# Altium project oleks-charge-verification.PrjPCB
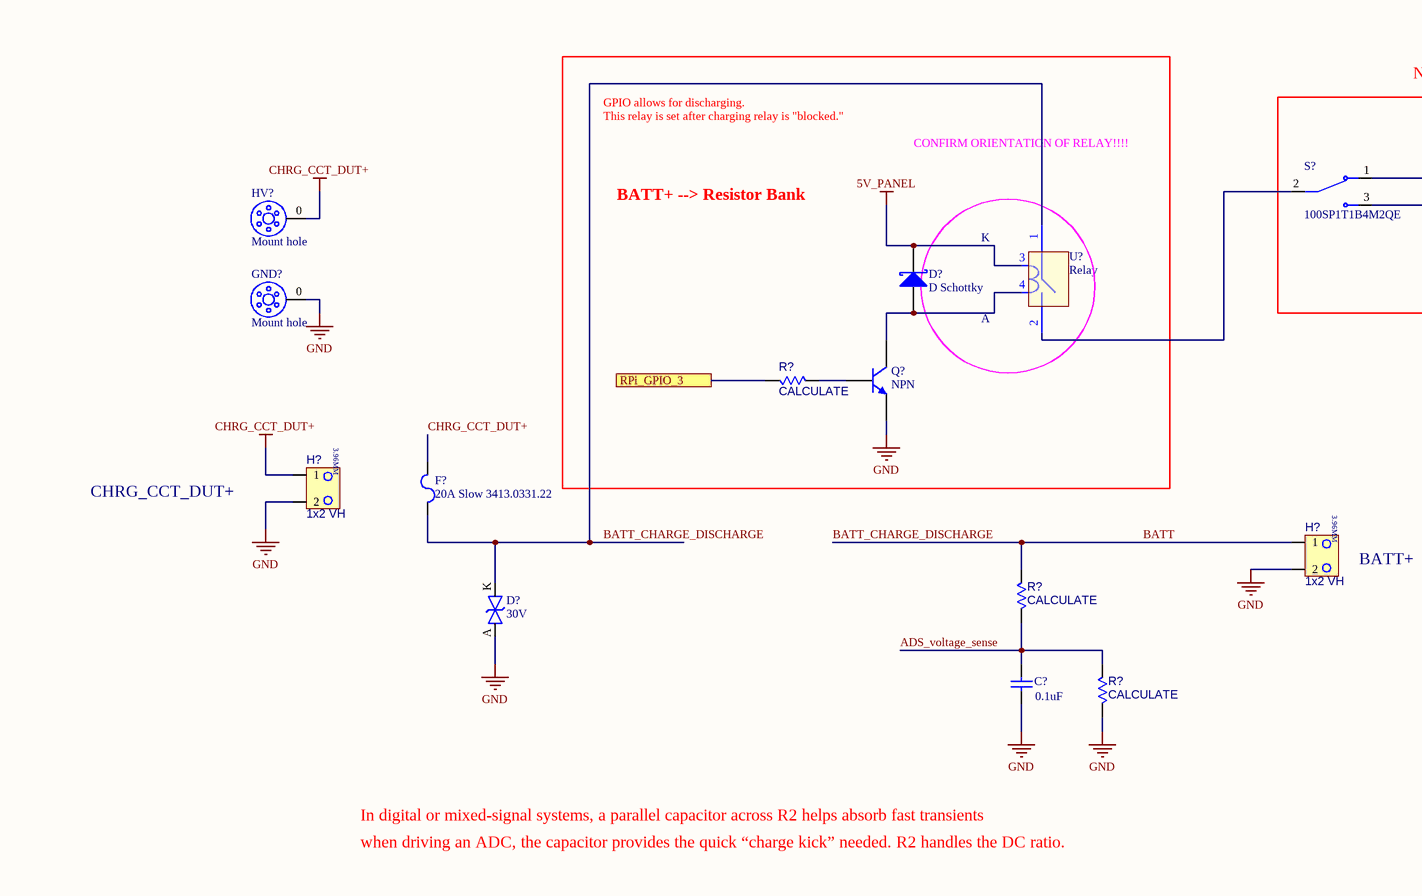
[diagram p0: oleks-charge-verification.SchDoc, top left]
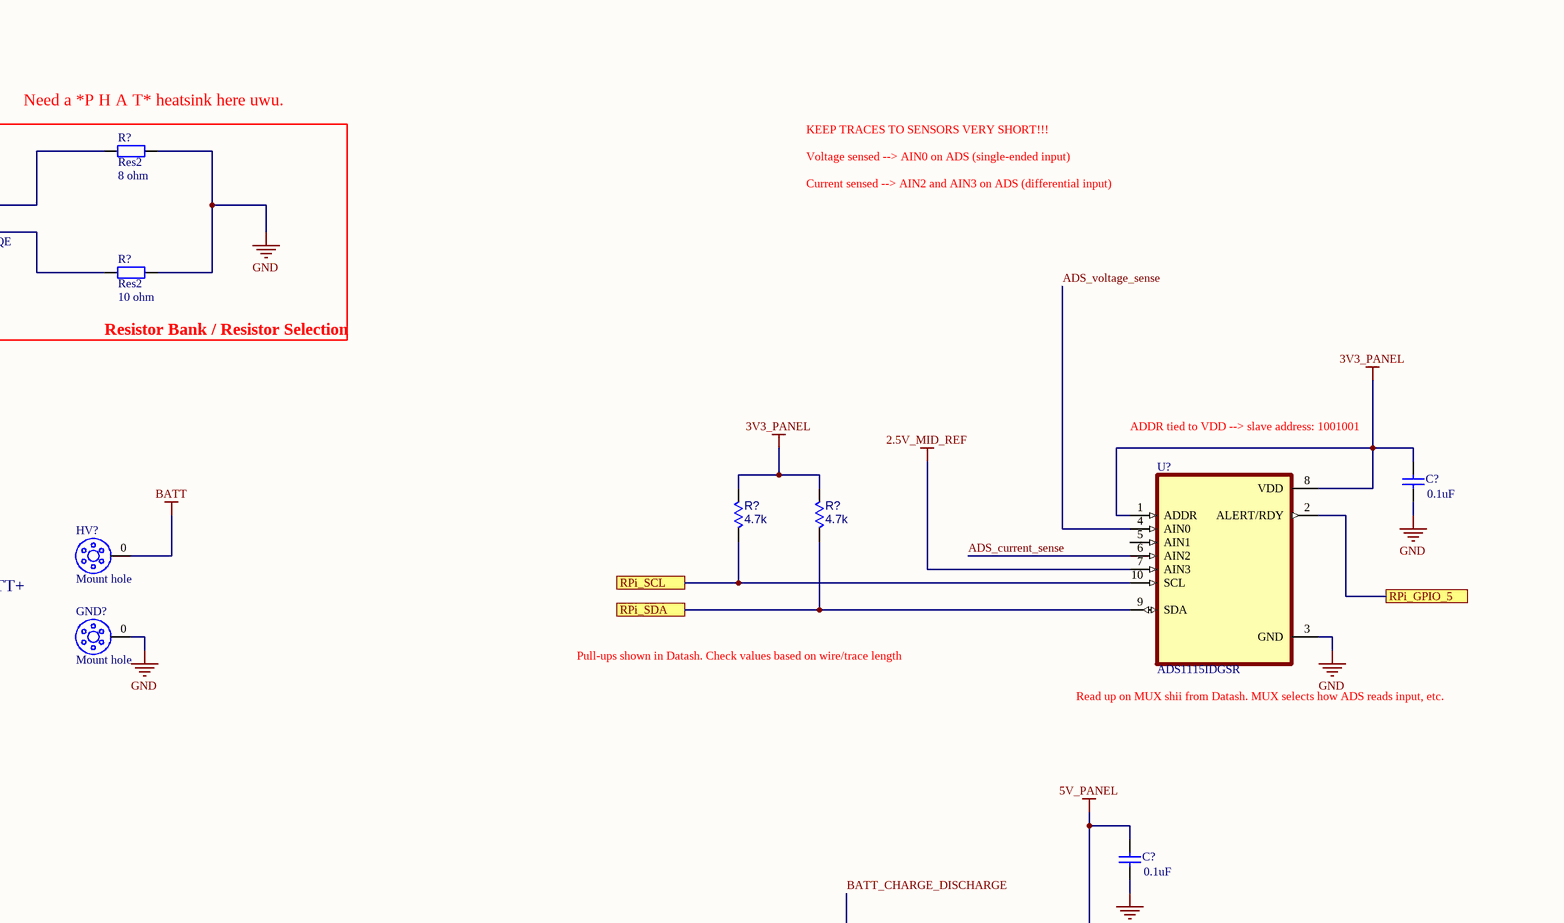
[diagram p1: oleks-charge-verification.SchDoc, top middle]
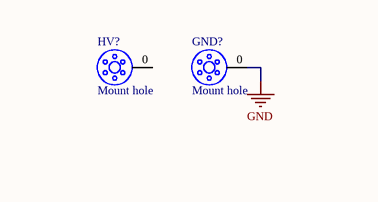
[diagram p2: oleks-charge-verification.SchDoc, top right]
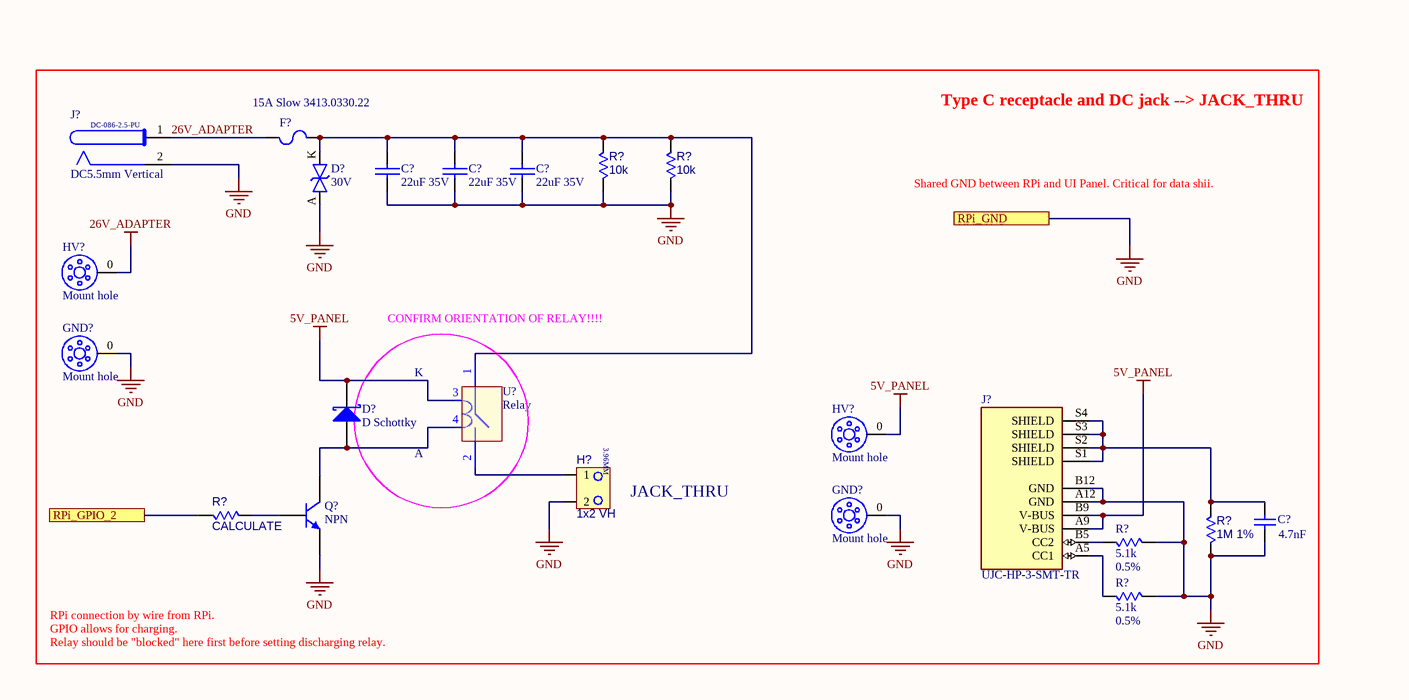
[diagram p3: oleks-charge-verification.SchDoc, bottom left]
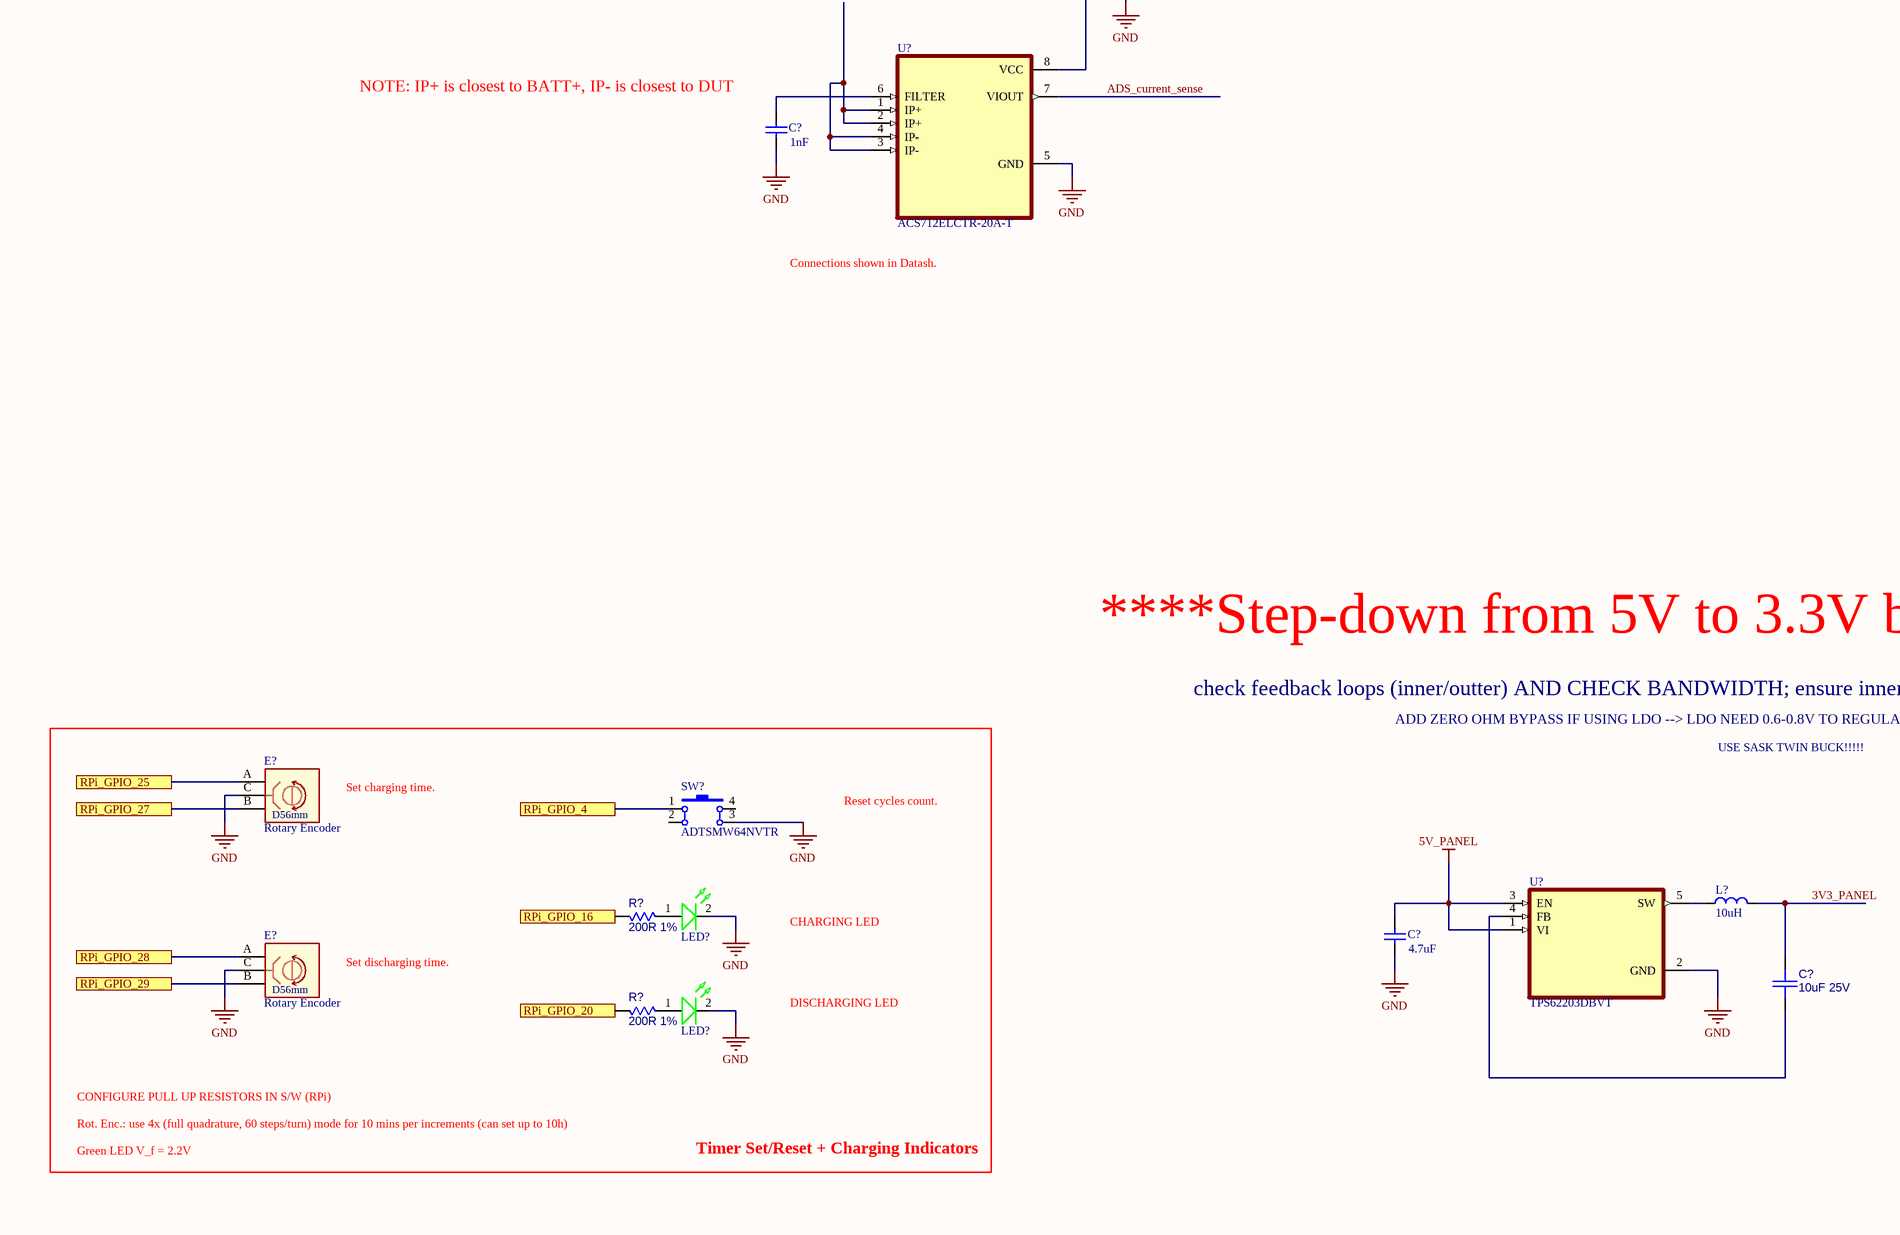
[diagram p4: oleks-charge-verification.SchDoc, bottom middle]
1 sheet, 60 parts. Net scope: flat (ports and power ports of the same name join across sheets).

## Sheet oleks-charge-verification.SchDoc
size D

### Parts
(Parts that share a designator on the sheet are numbered #1, #2 ... from top to bottom, then left to right.)
C?#1  value 0.1uF  [RAD-0.3]  (hidden comment: Cap)
C?#2  value 0.1uF  [RAD-0.3]  (hidden comment: Cap)
C?#3  value 0.1uF  [RAD-0.3]  (hidden comment: Cap)
C?#4  value 1nF  [RAD-0.3]  (hidden comment: Cap)
C?#5  22uF 35V  [CAPACITOR - 0805]
C?#6  22uF 35V  [CAPACITOR - 0805]
C?#7  22uF 35V  [CAPACITOR - 0805]
C?#8  value 4.7uF  [RAD-0.3]  (hidden comment: Cap)
C?#9  10uF 25V  [Capacitor - 0603]
C?#10  value 4.7nF  [RAD-0.3]  (hidden comment: Cap)
D?#1  D Schottky
D?#2  30V  [Diode - TVS - DO-214AC, SMA]
D?#3  30V  [Diode - TVS - DO-214AC, SMA]
D?#4  D Schottky
E?#1  Rotary Encoder  [Encoder - 56mm]
E?#2  Rotary Encoder  [Encoder - 56mm]
F?#1  20A Slow 3413.0331.22  [FUSE - 1206]
F?#2  15A Slow 3413.0330.22  [FUSE - 1206]
GND?#1  Mount hole  [MOUNT HOLE - 2mm]
GND?#2  Mount hole  [MOUNT HOLE - 2mm]
GND?#3  Mount hole  [MOUNT HOLE - 2mm]
GND?#4  Mount hole  [MOUNT HOLE - 2mm]
GND?#5  Mount hole  [MOUNT HOLE - 2mm]
H?#1  1x2 VH  [HEADER - SPEAKER CONN - Right  Angle]
H?#2  1x2 VH  [HEADER - SPEAKER CONN - Right  Angle]
H?#3  1x2 VH  [HEADER - SPEAKER CONN - Right  Angle]
HV?#1  Mount hole  [MOUNT HOLE - 2mm]
HV?#2  Mount hole  [MOUNT HOLE - 2mm]
HV?#3  Mount hole  [MOUNT HOLE - 2mm]
HV?#4  Mount hole  [MOUNT HOLE - 2mm]
HV?#5  Mount hole  [MOUNT HOLE - 2mm]
J?#1  DC5.5mm Vertical  [Jack - 5.5MM - VERTICAL - CYLINDER]
J?#2  UJC-HP-3-SMT-TR  [CUI_UJC-HP-3-SMT-TR]
L?  10uH  [INDUCTOR - 4mm x 4mm - POWER]
LED?#1  Green  [LED - P2.54MM - Green]  (value not drawn)
LED?#2  Green  [LED - P2.54MM - Green]  (value not drawn)
Q?#1  NPN  [TO-226-AA]
Q?#2  NPN  [TO-226-AA]
R?#1  Res2  value 8 ohm  [AXIAL-0.4]
R?#2  Res2  value 10 ohm  [AXIAL-0.4]
R?#3  CALCULATE  [Resistor - 0603]
R?#4  4.7k  [Resistor - 0603]
R?#5  4.7k  [Resistor - 0603]
R?#6  CALCULATE  [Resistor - 0603]
R?#7  CALCULATE  [Resistor - 0603]
R?#8  10k  [Resistor - 0603]
R?#9  10k  [Resistor - 0603]
R?#10  200R 1%  [Resistor - 0603]
R?#11  200R 1%  [Resistor - 0603]
R?#12  CALCULATE  [Resistor - 0603]
R?#13  1M 1%  [Resistor - 0603]
R?#14  5.1k  Tolerance: 0.5%  [0603_R_Fancy]
R?#15  5.1k  Tolerance: 0.5%  [0603_R_Fancy]
S?  100SP1T1B4M2QE  [SW_100SP1T1B4M2QE]
SW?  ADTSMW64NVTR  [Switch tactile - 6.3x6.2mm H4.5mm]
U?#1  Relay
U?#2  ADS1115IDGSR  [SOP50P490X110-10N]
U?#3  ACS712ELCTR-20A-T  [SOIC127P600X175-8N]
U?#4  TPS62203DBVT  [SOT95P280X145-5N]
U?#5  Relay

### Blocks framed on the sheet
BATT+ --> Resistor Bank: D?#1 Q?#1 R?#3 U?#1
Timer Set/Reset + Charging Indicators: E?#1 E?#2 LED?#1 LED?#2 R?#10 R?#11 SW?

### Ports
RPi_GND, RPi_GPIO_2, RPi_GPIO_3, RPi_GPIO_4, RPi_GPIO_5, RPi_GPIO_16, RPi_GPIO_20, RPi_GPIO_25, RPi_GPIO_27, RPi_GPIO_28, RPi_GPIO_29, RPi_SCL, RPi_SDA

### Nets
2.5V_MID_REF: U?#2.7(AIN3)
3V3_PANEL: C?#1.2 C?#9.2 L?.2 R?#4.1 R?#5.1 U?#2.1(ADDR) U?#2.8(VDD)
5V_PANEL: C?#3.2 C?#8.2 D?#1.2(K) D?#4.2(K) HV?#5.0(Pad) J?#2.A9(V-BUS) J?#2.B9(V-BUS) U?#1.3(IN) U?#3.8(VCC) U?#4.1(VI) U?#4.3(EN) U?#5.3(IN)
26V_ADAPTER: F?#2.1 HV?#4.0(Pad) J?#1.1(VCC)
BATT: D?#2.K F?#1.1 H?#2.1 HV?#3.0(Pad) R?#6.1 U?#1.1(IN) U?#3.1(IP+) U?#3.2(IP+) U?#3.3(IP-) U?#3.4(IP-)  [also labelled BATT_CHARGE_DISCHARGE]
CHRG_CCT_DUT+: F?#1.2 H?#1.1 HV?#2.0(Pad)
GND: C?#1.1 C?#2.1 C?#3.1 C?#4.1 C?#5.2 C?#6.2 C?#7.2 C?#8.1 C?#10.1 D?#2.A D?#3.A E?#1.C E?#2.C GND?#1.0(Pad) GND?#2.0(Pad) GND?#3.0(Pad) GND?#4.0(Pad) GND?#5.0(Pad) H?#1.2 H?#2.2 H?#3.2 J?#1.2(GND) J?#2.A12(GND) J?#2.B12(GND) LED?#1.2 LED?#2.2 Q?#1.3(E) Q?#2.3(E) R?#1.2 R?#2.2 R?#7.2 R?#8.1 R?#9.1 R?#13.1 R?#14.2 R?#15.2 SW?.3 U?#2.3(GND) U?#3.5(GND) U?#4.2(GND) ; port RPi_GND
ADS_current_sense: U?#2.6(AIN2) U?#3.7(VIOUT)
ADS_voltage_sense: C?#2.2 R?#6.2 R?#7.1 U?#2.4(AIN0)
NetC?#4_2: C?#4.2 U?#3.6(FILTER)
NetC?#5_1: C?#5.1 C?#6.1 C?#7.1 D?#3.K F?#2.2 R?#8.2 R?#9.2 U?#5.1(IN)
NetC?#9_1: C?#9.1 U?#4.4(FB)
NetC?#10_2: C?#10.2 J?#2.S1(SHIELD) J?#2.S2(SHIELD) J?#2.S3(SHIELD) J?#2.S4(SHIELD) R?#13.2
NetD?#1_1: D?#1.1(A) Q?#1.1(C) U?#1.4(IN)
NetD?#4_1: D?#4.1(A) Q?#2.1(C) U?#5.4(IN)
NetE?#1_A: E?#1.A ; port RPi_GPIO_25
NetE?#1_B: E?#1.B ; port RPi_GPIO_27
NetE?#2_A: E?#2.A ; port RPi_GPIO_28
NetE?#2_B: E?#2.B ; port RPi_GPIO_29
NetH?#3_1: H?#3.1 U?#5.2(IN)
NetJ?#2_A5: J?#2.A5(CC1) R?#15.1
NetJ?#2_B5: J?#2.B5(CC2) R?#14.1
NetL?_1: L?.1 U?#4.5(SW)
NetLED?#1_1: LED?#1.1 R?#10.1
NetLED?#2_1: LED?#2.1 R?#11.1
NetQ?#1_2: Q?#1.2(B) R?#3.1
NetQ?#2_2: Q?#2.2(B) R?#12.1
NetR?#1_1: R?#1.1 S?.1
NetR?#2_1: R?#2.1 S?.3
NetR?#3_2: R?#3.2 ; port RPi_GPIO_3
NetR?#4_2: R?#4.2 U?#2.10(SCL) ; port RPi_SCL
NetR?#5_2: R?#5.2 U?#2.9(SDA) ; port RPi_SDA
NetR?#10_2: R?#10.2 ; port RPi_GPIO_16
NetR?#11_2: R?#11.2 ; port RPi_GPIO_20
NetR?#12_2: R?#12.2 ; port RPi_GPIO_2
NetS?_2: S?.2 U?#1.2(IN)
NetSW?_1: SW?.1 ; port RPi_GPIO_4
NetU?#2_2: U?#2.2(ALERT/RDY) ; port RPi_GPIO_5

Not connected (* = marked no-connect by the designer): HV?#1 0(Pad); SW? 2 4; U?#2 5(AIN1)

### Notes on the sheet
- GPIO allows for discharging.
- This relay is set after charging relay is "blocked."
- (near R?#1) Need a *P H A T* heatsink here uwu.
- KEEP TRACES TO SENSORS VERY SHORT!!!
- CONFIRM ORIENTATION OF RELAY!!!!
- Voltage sensed --> AIN0 on ADS (single-ended input)
- Current sensed --> AIN2 and AIN3 on ADS (differential input)
- (near U?#1) K
- (near U?#1) A
- (near R?#2) Resistor Bank / Resistor Selection
- ADDR tied to VDD --> slave address: 1001001
- CHRG_CCT_DUT+
- BATT+
- Pull-ups shown in Datash. Check values based on wire/trace length
- Read up on MUX shii from Datash. MUX selects how ADS reads input, etc.
- In digital or mixed-signal systems, a parallel capacitor across R2 helps absorb fast transients
- when driving an ADC, the capacitor provides the quick “charge kick” needed. R2 handles the DC ratio.
- (near C?#4) NOTE: IP+ is closest to BATT+, IP- is closest to DUT
- Connections shown in Datash.
- Type C receptacle and DC jack --> JACK_THRU
- ****Step-down from 5V to 3.3V because don't screw up RPi.
- Shared GND between RPi and UI Panel. Critical for data shii.
- check feedback loops (inner/outter) AND CHECK BANDWIDTH; ensure inner loop has 10x BW of outter loop --> or circuit can entier instability
- ADD ZERO OHM BYPASS IF USING LDO --> LDO NEED 0.6-0.8V TO REGULATE (COULD MAYBE NOT REGULATE TO 3.3V)
- Set charging time.
- Reset cycles count.
- USE SASK TWIN BUCK!!!!!
- (near U?#5) K
- CHARGING LED
- (near U?#5) A
- Set discharging time.
- DISCHARGING LED
- JACK_THRU
- CONFIGURE PULL UP RESISTORS IN S/W (RPi)
- Rot. Enc.: use 4x (full quadrature, 60 steps/turn) mode for 10 mins per increments (can set up to 10h)
- RPi connection by wire from RPi.
- GPIO allows for charging.
- Relay should be "blocked" here first before setting discharging relay.
- Green LED V_f = 2.2V
- (in symbol Header - 1x2 - speaker conn - Right Angle) 3.96MM
- (in symbol Rotary Encoder - 56mm - TH) D56mm

### Library data of the parts
C?#1-C?#4 C?#8 C?#10 = Cap: Capacitor; Published: 8-Jun-2000; LatestRevisionDate: 17-Jul-2002; LatestRevisionNote: Re-released for DXP Platform.; PackageReference: RAD-0.3; Publisher: Altium Limited; PackageDescription: Radial Cap, Thru-Hole; 2 Leads; 0.3 in Pin Spacing
C?#5-C?#7 = Capacitor - 22uF - 0805 - 35V: 22 µF ±20% 35V Ceramic Capacitor X5R 0805 (2012 Metric); MFG: TDK Corporation; MFG_PN: C2012X5R1V226M125AC; AVL: NO; Digi-Key_PN: 445-14428-1-ND; Voltage: 35V; MOUSER_PN: N/A
C?#9 = Capacitor - 10uF - 0603: 10 µF ±20% 25V Ceramic Capacitor X5R 0603 (1608 Metric); MFG: Murata Electronics; MFG_PN: GRT188R61E106ME13D; AVL: NO; Digi-Key_PN: 490-12323-1-ND; Voltage Rating: 25V; MOUSER_PN: N/A
D?#1 D?#4 = D Schottky: DIODE SCHOTTKY 30V 1A DO41; Manufacturer Part Number: 1N5818
D?#2 D?#3 = Diode - TVS - 30V Power: 48.4V Clamp 8.3A Ipp Tvs Diode Surface Mount DO-214AC; MFG: Würth Elektronik; MFG_PN: SMAJ30CA; AVL: NO; Digi-Key_PN: 732-SMAJ30CACT-ND
E?#1 E?#2 = Rotary Encoder - 56mm - TH: Rotary Encoder Incremental 15 Quadrature, 2-Bit Vertical; MFG: Bourns Inc.; MFG_PN: PER561-P115-N0015; AVL: NO; Digi-Key_PN: 118-PER561-P115-N0015-ND
F?#1 = Fuse - 20A: 20 A 32 V AC 63 V DC Fuse Board Mount (Cartridge Style Excluded) Surface Mount 1206 (3216 Metric); MFG: SCHURTER Inc.; AVL: NO; Size: 1206; ComponentLink1Description: datasheet; ComponentLink1URL: C:\Users\Adam\Desktop\Reference\datasheets\fuses\C1Q.pdf; MFG_PN: 3413.0331.22; Digi-Key_PN: 486-1689-1-ND; Current: 20A
F?#2 = Fuse - 15A: 15 A 32 V AC 63 V DC Fuse Board Mount (Cartridge Style Excluded) Surface Mount 1206 (3216 Metric); MFG: SCHURTER Inc.; AVL: NO; Size: 1206; ComponentLink1Description: datasheet; ComponentLink1URL: C:\Users\Adam\Desktop\Reference\datasheets\fuses\C1Q.pdf; MFG_PN: 3413.0330.22; Digi-Key_PN: 486-1688-1-ND; Current: 15A
GND?#1-GND?#5 HV?#1-HV?#5 = Mount hole - 2mm: Do not include in BOM. Board mechanical feature.; Digi-Key_PN: N/A; MFG: N/A; MFG_PN: N/A
H?#1-H?#3 = Header - 1x2 - speaker conn - Right Angle: Connector Header Through Hole, Right Angle 2 position 0.156" (3.96mm); MFG: TE Connectivity AMP Connectors; MFG_PN: 647676-2; Current Rating: 7.5A; Voltage Rating: 250VAC; AVL: NO; Digi-Key_PN: A114288-ND; ComponentLink1Description: datasheet; ComponentLink1URL: C:\Users\Adam\Desktop\Reference\datasheets\headers\JST - VH.pdf; ComponentLink2Description: online datasheet; ComponentLink2URL: http://www.jst-mfg.com/product/pdf/eng/eVH.pdf; Pitch - Mating: 3.96mm
J?#1 = Jack - DC5.5mm - Vertical: DC Mate Plug. Supplied by Longjoin.; MFG: Dongguang  Haoyu Electronics Co. , LTD; MFG_PN: DC-086-2.5-PU; AVL: NO; Digi-Key_PN: N/A; ComponentLink1Description: datasheet; ComponentLink1URL: C:\Users\Adam\Desktop\Reference\datasheets\jacks - RF\Amphenol - SMA TH ST - 132134.pdf; ComponentLink2Description: online datasheet; ComponentLink2URL: https://www.amphenolrf.com/media/downloads/2187/132134.pdf
L? = Inductor - 10uH - 4mm x 4mm: 10 µH Shielded Wirewound Inductor 1.2 A 180mOhm Max Nonstandard; MFG: Taiyo Yuden; MFG_PN: NRS4018T100MDGJ; Current: 1.2A; AVL: NO; Digi-Key_PN: 587-2886-1-ND
LED?#1 LED?#2 = LED - Green -  P2.54mm: Green 568nm LED Indication - Discrete 2.2V Radial; MFG: Würth Elektronik; MFG_PN: 151031VS06000; AVL: NO; Digi-Key_PN: 732-5008-ND
Q?#1 Q?#2 = NPN: NPN Bipolar Transistor; Published: 8-Jun-2000; LatestRevisionDate: 17-Jul-2002; LatestRevisionNote: Re-released for DXP Platform.; PackageReference: TO-226-AA; Publisher: Altium Limited; PackageDescription: TO, Flat Index; 3 In-Line, Axial Leads; Body Dia. 4.8mm; Leads 0.55 x 0.51 mm (max); Code_JEDEC: TO-226-AA
R?#1 R?#2 = Res2: Resistor; Published: 8-Jun-2000; LatestRevisionDate: 17-Jul-2002; LatestRevisionNote: Re-released for DXP Platform.; PackageReference: AXIAL-0.4; Publisher: Altium Limited; PackageDescription: Axial Device, Thru-Hole; 2 Leads; 0.4 in Pin Spacing
R?#3 R?#6-R?#9 R?#12 = Resistor - 10k - 0603: 10 kOhms ±1% 0.1W, 1/10W Chip Resistor 0603 (1608 Metric) Automotive AEC-Q200 Thick Film; MFG: Stackpole Electronics Inc; MFG_PN: RMCF0603FT10K0; AVL: NO; Digi-Key_PN: RMCF0603FT10K0CT-ND
R?#4 R?#5 = Resistor - 4.7k - 0603: MFG: YAGEO; MFG_PN: RC0603FR-074K7L; AVL: NO; Digi-Key_PN: 311-4.70KHRCT-ND
R?#10 R?#11 = Resistor - 200R - 0603: 200 Ohms ±1% 0.1W, 1/10W Chip Resistor 0603 (1608 Metric) Automotive AEC-Q200 Thick Film; MFG: Stackpole Electronics Inc; MFG_PN: RMCF0603FT200R; AVL: NO; Digi-Key_PN: RMCF0603FT200RCT-ND
R?#13 = Resistor - 1M - 0603: 1 MOhms ±1% 0.1W, 1/10W Chip Resistor 0603 (1608 Metric) Automotive AEC-Q200 Thick Film; MFG: NIC Components Corp; MFG_PN: NRC06F1004TRF; AVL: NO; Digi-Key_PN: 4988-NRC06F1004TRFCT-ND; DNS: NO
R?#14 R?#15 = R_0603_5.1k_0.5%: 5.1 kOhms ±0.5% 0.1W, 1/10W Chip Resistor 0603 (1608 Metric) Thin Film; MFG: Yageo; MFG_PN: RT0603DRD075K1L; Digi-Key_PN: 311-5.1KDCT-ND
S? = 100SP1T1B4M2QE: Toggle Switch SPDT Through Hole; Package: None; Price: None; Value: *; MP: 100SP1T1B4M2QE; Availability: Unavailable
SW? = Switch - Tactile - 6.2x6.3 H4.5mm: Tactile Switch SPST-NO Top Actuated Surface Mount; MFG: APEM Inc.; Digi-Key_PN: 679-2310-1-ND; MFG_PN: ADTSMW64NVTR; ComponentLink1Description: datasheet; ComponentLink1URL: C:\Users\Adam\Desktop\Reference\datasheets\switch - PB\E-Switch - TL3301 Series.pdf
U?#1 U?#5 = Relay: General Purpose Relay SPST-NO (1 Form A) 5VDC Coil Through Hole; Manufacturer Product Number: AZ943-1AH-5DE
U?#2 = ADS1115IDGSR: 16-bit, 860-SPS, 4-channel, delta-sigma ADC with PGA, oscillator, VREF, comparator and I2C; MF: Texas Instruments; SnapEDA_Link: https://www.snapeda.com/parts/ADS1115IDGSR/Texas+Instruments/view-part/?ref=snap; Package: VSSOP-10 Texas Instruments; Value: *; MP: ADS1115IDGSR; Check_prices: https://www.snapeda.com/parts/ADS1115IDGSR/Texas+Instruments/view-part/?ref=eda
U?#3 = ACS712ELCTR-20A-T: Current Sensor 20A 1 Channel Hall Effect, Open Loop Bidirectional 8-SOIC (0.154, 3.90mm Width); MF: Allegro MicroSystems LLC; MP: ACS712ELCTR20AT; SnapEDA_Link: https://www.snapeda.com/parts/ACS712ELCTR20AT/Allegro/view-part/?ref=snap; Package: SOIC-8 Allegro; Value: *; Check_prices: https://www.snapeda.com/parts/ACS712ELCTR20AT/Allegro/view-part/?ref=eda
U?#4 = TPS62203DBVT: 3.3-V Output, 300-mA, 95% Efficient Step-Down Converter in SOT-23; MF: Texas Instruments; SnapEDA_Link: https://www.snapeda.com/parts/TPS62203DBVT/Texas+Instruments/view-part/?ref=snap; Package: SOT-23-5 Texas Instruments; Value: *; MP: TPS62203DBVT; Check_prices: https://www.snapeda.com/parts/TPS62203DBVT/Texas+Instruments/view-part/?ref=eda
J?#2 = UJC-HP-3-SMT-TR: Package: None; Price: None; Value: *; MP: UJC-HP-3-SMT-TR; Availability: Unavailable